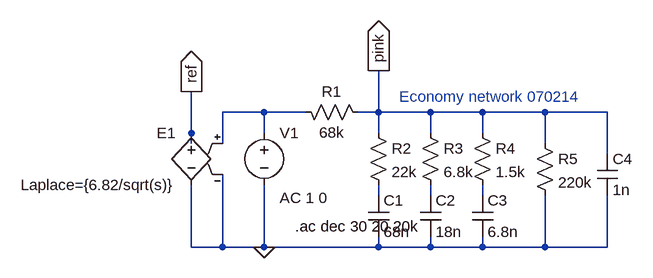
[diagram p0: schematic Economy network.asc]
Economy network.asc, the LTspice schematic file:
Version 4
SHEET 1 880 680
WIRE -128 128 -192 128
WIRE -64 128 -128 128
WIRE 48 128 48 64
WIRE 48 128 16 128
WIRE 128 128 48 128
WIRE 208 128 128 128
WIRE 304 128 208 128
WIRE 400 128 304 128
WIRE -240 160 -240 96
WIRE -128 160 -128 128
WIRE 48 160 48 128
WIRE 128 160 128 128
WIRE 208 160 208 128
WIRE -240 176 -240 160
WIRE -192 176 -192 128
WIRE 304 176 304 128
WIRE 400 192 400 128
WIRE 48 256 48 240
WIRE 128 256 128 240
WIRE 208 256 208 240
WIRE -240 336 -240 240
WIRE -192 336 -192 224
WIRE -192 336 -240 336
WIRE -128 336 -128 240
WIRE -128 336 -192 336
WIRE 48 336 48 320
WIRE 48 336 -128 336
WIRE 128 336 128 320
WIRE 128 336 48 336
WIRE 208 336 208 320
WIRE 208 336 128 336
WIRE 304 336 304 256
WIRE 304 336 208 336
WIRE 400 336 400 256
WIRE 400 336 304 336
FLAG -128 336 0
FLAG -240 96 ref
IOPIN -240 96 Out
FLAG 48 64 pink
IOPIN 48 64 Out
SYMBOL voltage -128 144 R0
WINDOW 123 24 116 Left 0
WINDOW 39 0 0 Left 0
SYMATTR Value2 AC 1 0
SYMATTR InstName V1
SYMATTR Value ""
SYMBOL res 32 144 M270
WINDOW 0 32 56 VTop 0
WINDOW 3 0 56 VBottom 0
SYMATTR InstName R1
SYMATTR Value 68k
SYMBOL res 32 144 R0
SYMATTR InstName R2
SYMATTR Value 22k
SYMBOL res 112 144 R0
SYMATTR InstName R3
SYMATTR Value 6.8k
SYMBOL res 192 144 R0
SYMATTR InstName R4
SYMATTR Value 1.5k
SYMBOL cap 32 256 R0
SYMATTR InstName C1
SYMATTR Value 68n
SYMBOL cap 112 256 R0
SYMATTR InstName C2
SYMATTR Value 18n
SYMBOL cap 192 256 R0
SYMATTR InstName C3
SYMATTR Value 6.8n
SYMBOL res 288 160 R0
SYMATTR InstName R5
SYMATTR Value 220k
SYMBOL cap 384 192 R0
SYMATTR InstName C4
SYMATTR Value 1n
SYMBOL e -240 144 M0
SYMATTR InstName E1
SYMATTR Value Laplace={6.82/sqrt(s)}
TEXT -80 304 Left 0 !.ac dec 30 20 20k
TEXT 80 104 Left 0 ;Economy network 070214

The netlist it stands for:
* Economy network.asc
V1 N001 0 AC 1 0
R1 pink N001 68k
R2 pink N002 22k
R3 pink N003 6.8k
R4 pink N004 1.5k
C1 N002 0 68n
C2 N003 0 18n
C3 N004 0 6.8n
R5 pink 0 220k
C4 pink 0 1n
E1 ref 0 N001 0 Laplace={6.82/sqrt(s)}
.ac dec 30 20 20k
* Economy network 070214
.backanno
.end